# Altium schematic sheet modFOC-Inputs.SchDoc: modFOC-Inputs
size A4; Author: Mathias Giller; CompanyName: HTL St. Pölten; Address1: modFOC; DocumentNumber: 2; Revision: 2.0; SheetNumber: 2; SheetTotal: 7
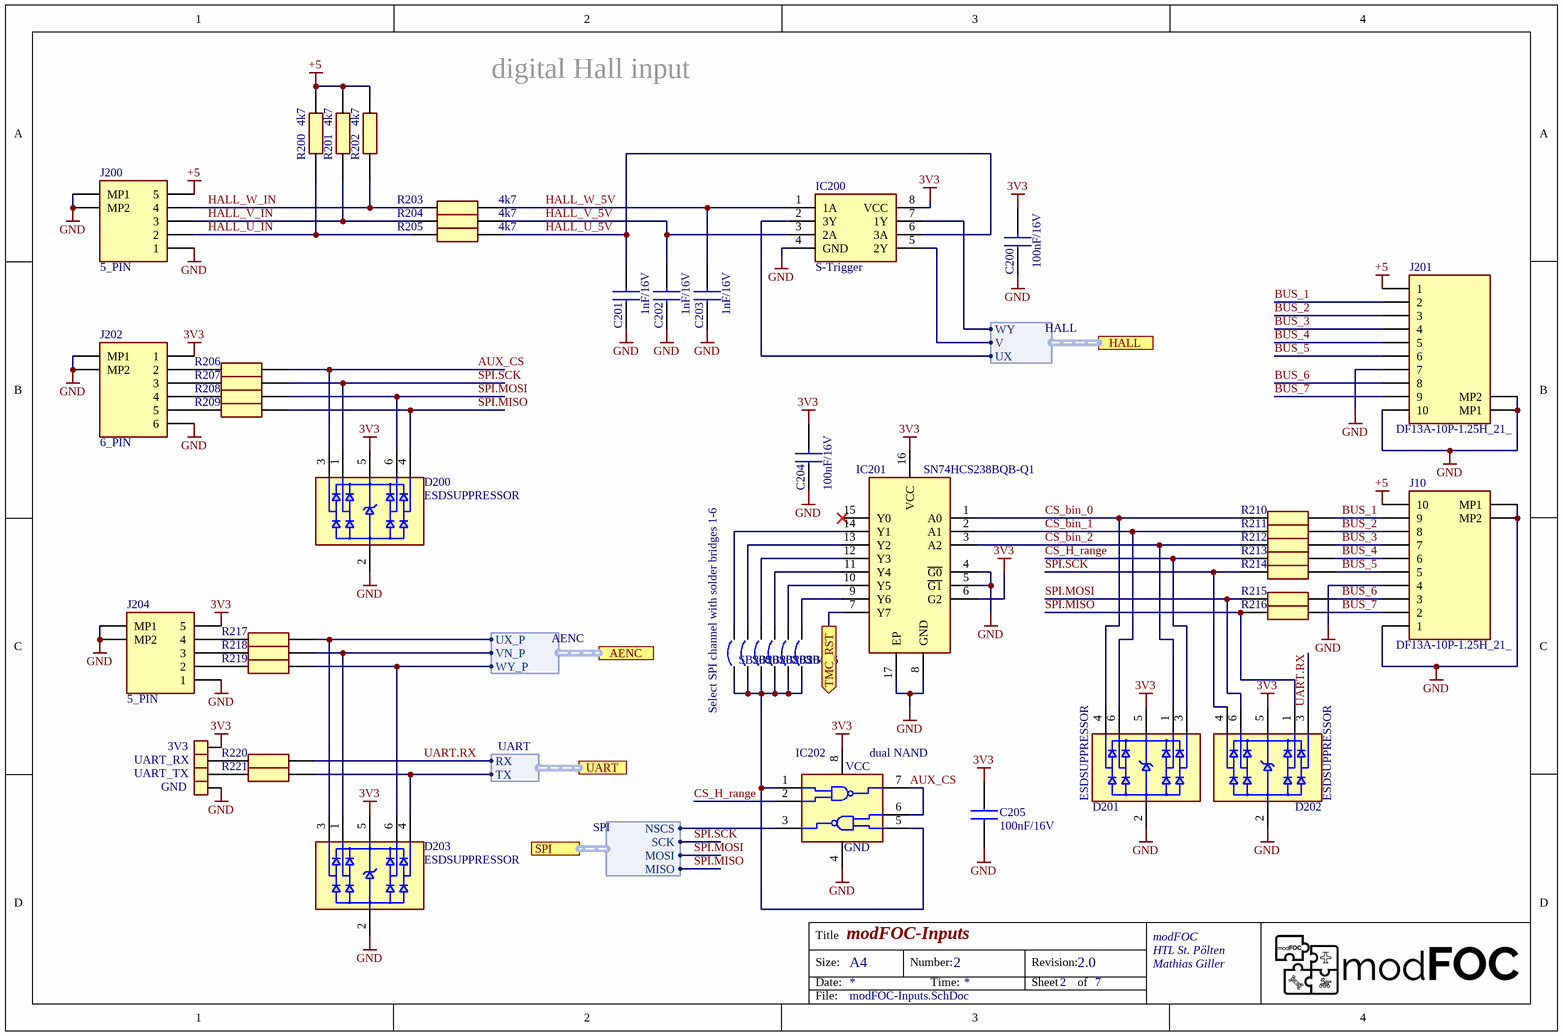
[diagram p0: modFOC-Inputs.SchDoc]

## Parts
C200  100nF/16V  [CAPC1608X97N]
C201  1nF/16V  [CAPC1608X97N]
C202  1nF/16V  [CAPC1608X97N]
C203  1nF/16V  [CAPC1608X97N]
C204  100nF/16V  [CAPC1608X97N]
C205  100nF/16V  [CAPC1608X97N]
D200  ESDSUPPRESSOR  [SOT23-6]
D201  ESDSUPPRESSOR  [SOT23-6]
D202  ESDSUPPRESSOR  [SOT23-6]
D203  ESDSUPPRESSOR  [SOT23-6]
IC200  S-Trigger  [SOP65P400X110-8N]
IC201  SN74HCS238BQB-Q1  [SN74HCS238BQB-Q1]
IC202  dual NAND  [74AUP1G74GF115]
J10  DF13A-10P-1.25H_21_  [DF13A10P125H21]
J200  5_PIN  [DF13A5P125H21]
J201  DF13A-10P-1.25H_21_  [DF13A10P125H21]
J202  6_PIN  [DF13A6P125H21]
J204  5_PIN  [DF13A5P125H21]
J205  3V3  [Pin]
J206  UART_RX  [Pin]
J207  UART_TX  [Pin]
J208  GND  [Pin]
R200  4k7  [RESC1608X55N]
R201  4k7  [RESC1608X55N]
R202  4k7  [RESC1608X55N]
R203  4k7  [RESC1608X55N]
R204  4k7  [RESC1608X55N]
R205  4k7  [RESC1608X55N]
R206  100R  [RESC1005X40N]  (value not drawn)
R207  100R  [RESC1005X40N]  (value not drawn)
R208  100R  [RESC1005X40N]  (value not drawn)
R209  100R  [RESC1005X40N]  (value not drawn)
R210  100R  [RESC1005X40N]  (value not drawn)
R211  100R  [RESC1005X40N]  (value not drawn)
R212  100R  [RESC1005X40N]  (value not drawn)
R213  100R  [RESC1005X40N]  (value not drawn)
R214  100R  [RESC1005X40N]  (value not drawn)
R215  100R  [RESC1005X40N]  (value not drawn)
R216  100R  [RESC1005X40N]  (value not drawn)
R217  100R  [RESC1005X40N]  (value not drawn)
R218  100R  [RESC1005X40N]  (value not drawn)
R219  100R  [RESC1005X40N]  (value not drawn)
R220  100R  [RESC1005X40N]  (value not drawn)
R221  100R  [RESC1005X40N]  (value not drawn)
SB200  Solder Bridge  [SOLDER-BRIDGE_R0603-0R]  (value not drawn)
SB201  Solder Bridge  [SOLDER-BRIDGE_R0603-0R]  (value not drawn)
SB202  Solder Bridge  [SOLDER-BRIDGE_R0603-0R]  (value not drawn)
SB203  Solder Bridge  [SOLDER-BRIDGE_R0603-0R]  (value not drawn)
SB204  Solder Bridge  [SOLDER-BRIDGE_R0603-0R]  (value not drawn)
SB205  Solder Bridge  [SOLDER-BRIDGE_R0603-0R]  (value not drawn)

## Ports
AENC (harness AENC), HALL (harness HALL), SPI (harness SPI), TMC_RST (out), UART (harness UART)

## Harnesses
UART: RX, TX
SPI: NSCS, SCK, MOSI, MISO
AENC: UX_P, VN_P, WY_P
HALL: WY, V, UX

## Nets
3V3: C200.2 C204.1 C205.1 D200.5(VDD) D201.5(VDD) D202.5(VDD) D203.5(VDD) IC200.8(VCC) IC201.6(G2) IC201.16(VCC) IC202.8 J202.1 J204.5 J205.1
+5: J10.10 J200.5 J201.1 R200.2 R201.2 R202.2
GND: C200.1 C201.2 C202.2 C203.2 C204.2 C205.2 D200.2(GND) D201.2(GND) D202.2(GND) D203.2(GND) IC200.4(GND) IC201.4(~{G0}) IC201.5(~{G1}) IC201.8(GND) IC201.17(EP) IC202.4 J10.1 J10.4 J10.MP1 J10.MP2 J200.1 J200.MP1 J200.MP2 J201.7 J201.10 J201.MP1 J201.MP2 J202.6 J202.MP1 J202.MP2 J204.1 J204.MP1 J204.MP2 J208.1
AUX_CS: D200.3(CH1) IC202.6(2B) IC202.7(1Y) R206.2
BUS_1: J10.9 J201.2 R210.2
BUS_2: J10.8 J201.3 R211.2
BUS_3: J10.7 J201.4 R212.2
BUS_4: J10.6 J201.5 R213.2
BUS_5: J10.5 J201.6 R214.2
BUS_6: J10.3 J201.8 R215.2
BUS_7: J10.2 J201.9 R216.2
CS_bin_0: D201.4(CH3) IC201.1(A0) R210.1
CS_bin_1: D201.6(CH2) IC201.2(A1) R211.1
CS_bin_2: D201.1(CH4) IC201.3(A2) R212.1
CS_H_range: D201.3(CH1) IC202.2(1B) R213.1
HALL_U_5V: C201.1 IC200.6(3A) R205.1
HALL_U_IN: J200.2 R200.1 R205.2
HALL_V_5V: C202.1 IC200.3(2A) R204.1
HALL_V_IN: J200.3 R201.1 R204.2
HALL_W_5V: C203.1 IC200.1(1A) R203.1
HALL_W_IN: J200.4 R202.1 R203.2
SPI.MISO: D200.4(CH3) D202.1(CH4) R209.2 R216.1 ; port SPI.MISO
SPI.MOSI: D200.6(CH2) D202.6(CH2) R208.2 R215.1 ; port SPI.MOSI
SPI.SCK: D200.1(CH4) D202.4(CH3) R207.2 R214.1 ; port SPI.SCK
TMC_RST: IC201.7(Y7) ; port TMC_RST
UART.RX: D202.3(CH1) R220.2 ; port UART.RX
NetD203_1: D203.1(CH4) R218.2 ; port AENC.VN_P
NetD203_3: D203.3(CH1) R217.2 ; port AENC.UX_P
NetD203_4: D203.4(CH3) R221.2 ; port UART.TX
NetD203_6: D203.6(CH2) R219.2 ; port AENC.WY_P
NetIC200_2: IC200.2(3Y) ; port HALL.UX
NetIC200_5: IC200.5(2Y) ; port HALL.V
NetIC200_7: IC200.7(1Y) ; port HALL.WY
NetIC201_9: IC201.9(Y6) SB205.2
NetIC201_10: IC201.10(Y5) SB204.2
NetIC201_11: IC201.11(Y4) SB203.2
NetIC201_12: IC201.12(Y3) SB202.2
NetIC201_13: IC201.13(Y2) SB201.2
NetIC201_14: IC201.14(Y1) SB200.2
NetIC202_1: IC202.1(1A) IC202.5(2A) SB200.1 SB201.1 SB202.1 SB203.1 SB204.1 SB205.1
NetIC202_3: IC202.3(2Y) ; port SPI.NSCS
NetJ202_2: J202.2 R206.1
NetJ202_3: J202.3 R207.1
NetJ202_4: J202.4 R208.1
NetJ202_5: J202.5 R209.1
NetJ204_2: J204.2 R219.1
NetJ204_3: J204.3 R218.1
NetJ204_4: J204.4 R217.1
NetJ206_1: J206.1 R220.1
NetJ207_1: J207.1 R221.1

Not connected (* = marked no-connect by the designer): IC201 15(Y0)*

## Notes on the sheet
- digital Hall input
- (near SB200) Select SPI channel with solder bridges 1-6
- Title
- Size:
- Date:
- A4
- Number:
- Time:
- Revision:
- Sheet
- of
- File:
- (in symbol 74AUP2G132GF,115) VCC; GND

## Library data of the parts
C200-C205 = C0603: Capacitor
D200-D203 = ESDSUPPRESSOR: TVS Diode (Uni-directional); Datasheet Link: *; Height: 0.6mm; Manufacturer_Name: *; Manufacturer_Part_Number: *; Mauser_Part_Number: *
IC200 = 74LVC3G17DP,125: 3x Schmitt trigger; Manufacturer_Name: Nexperia; Datasheet Link: https://assets.nexperia.com/documents/data-sheet/74LVC3G17.pdf; Height: 1.1mm; Manufacturer_Part_Number: 74LVC3G17DP,125; Mouser Part Number: 771-LVC3G17DP125; Mouser Price/Stock: https://www.mouser.co.uk/ProductDetail/Nexperia/74LVC3G17DP125?qs=me8TqzrmIYUUngWcw0uHGA%3D%3D; Arrow Part Number: 74LVC3G17DP,125; Arrow Price/Stock: https://www.arrow.com/en/products/74lvc3g17dp125/nexperia
IC201 = SN74HCS238BQB-Q1: 3bit bin to dec noninverting; Manufacturer_Name: Texas Instruments; Manufacturer_Part_Number: SN74HCS238QBQBRQ1; Datasheet Link: https://www.ti.com/lit/gpn/SN74HCS238-Q1; Height: 0.8mm; Mouser Part Number: 595-N74HCS238QBQBRQ1
IC202 = 74AUP2G132GF,115: Dual triple input NAND; Manufacturer_Name: Nexperia; Datasheet Link: https://assets.nexperia.com/documents/data-sheet/74AUP2G132.pdf; Manufacturer_Part_Number: 74AUP2G132GF,115; Mouser Part Number: 771-74AUP2G132GF115; Mouser Price/Stock: https://www.mouser.co.uk/ProductDetail/Nexperia/74AUP2G132GF115?qs=jquClx72t9AzfoBXotQVdg%3D%3D
J10 J201 = DF13A-10P-1.25H_21_: 10Pin DF13 Connector; Manufacturer_Name: Hirose; Manufacturer_Part_Number: DF13A-10P-1.25H(21); Datasheet Link: https://datasheet.datasheetarchive.com/originals/dk/DKDS-30/590349.pdf; Height: 3.75mm; Mouser Part Number: 798-DF13A10P125H21; Mouser Price/Stock: https://www.mouser.co.uk/ProductDetail/Hirose-Connector/DF13A-10P-125H21?qs=XQjbzJWzFPV7pEVOeMnY%2FQ%3D%3D; Arrow Part Number: DF13A-10P-1.25H(21); Arrow Price/Stock: https://www.arrow.com/en/products/df13a-10p-1.25h-21/hirose-electric
J200 J204 = DF13A-5P-1.25H_21_: Connector; Manufacturer_Name: Hirose; Manufacturer_Part_Number: DF13A-5P-1.25H(21); Datasheet Link: https://componentsearchengine.com/Datasheets/1/DF13A-5P-1.25H(21).pdf; Height: 3.75mm; Mouser Part Number: 798-DF13A5P125H21; Mouser Price/Stock: https://www.mouser.co.uk/ProductDetail/Hirose-Connector/DF13A-5P-125H21?qs=XQjbzJWzFPWvJsE2o%252B4Q8Q%3D%3D
J202 = DF13A-6P-1.25H_21_: 6 Pin DF13 Connector; Manufacturer_Name: Hirose; Manufacturer_Part_Number: DF13A-6P-1.25H(21); Datasheet Link: https://www.hirose.com/product/download/?distributor=digikey&type=2d&lang=en&num=DF13A-6P-1.25H(21); Height: 3.75mm; Mouser Part Number: 798-DF13A6P125H21; Mouser Price/Stock: https://www.mouser.co.uk/ProductDetail/Hirose-Connector/DF13A-6P-125H21?qs=XQjbzJWzFPXnreVi%252BPl0Lg%3D%3D; Arrow Part Number: DF13A-6P-1.25H(21); Arrow Price/Stock: https://www.arrow.com/en/products/df13a-6p-1.25h-21/hirose-electric
J205-J208 = Pin
R200-R205 = R0603: Resistor
R206-R221 = R0402: Resistor; Height: 0.4mm
SB200-SB205 = Solder Bridge: Internal_Part_Number: MCD-00071; Part_Type: Mechanical; Manufacturer_Part_Number: RC0603JR-070RL; Manufacturer: YAGEO; Provided_By: SUBCO; ECCN_US: n/a; ECCN_EU: n/a; Status: Released; Package: SB0603; ComponentLink1Description: Datasheet; ComponentLink1URL: http://tunmcdsvn.tun.st.com/Component_Datasheet_Library/Trunk/Resistors/Yageo_Resistor_RC0603-series